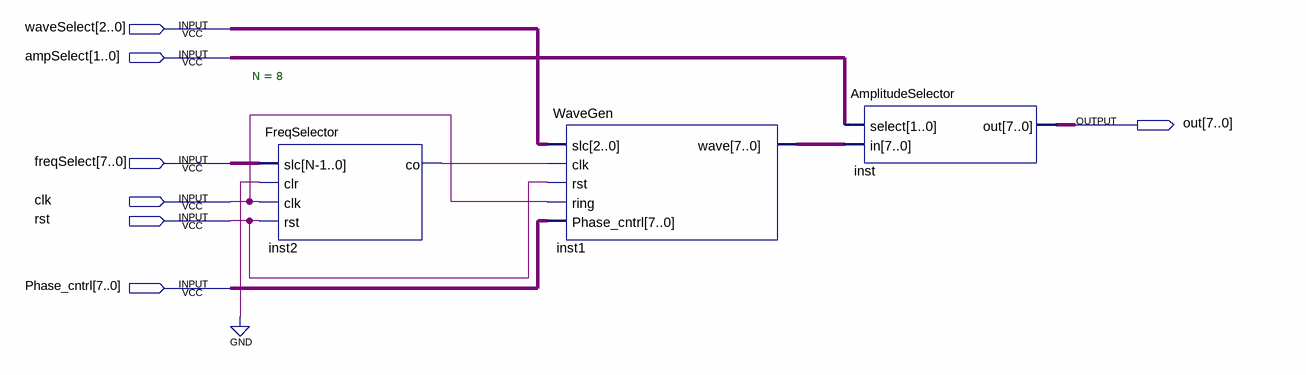
[diagram p0: schematic sheet]
// Quartus schematic FuncGen.bdf as structural Verilog: 3 symbols, 7 pins
module FuncGen (
  input  [2:0] waveSelect,
  input  [1:0] ampSelect,
  input  [7:0] freqSelect,
  input  clk,
  input  rst,
  input  [7:0] Phase_cntrl,
  output [7:0] out
);

  wire inst2_co;
  wire [7:0] inst1_wave;

  FreqSelector #(.N(8)) inst2 (.slc(freqSelect), .clr(1'b0), .clk(clk), .rst(rst), .co(inst2_co));
  WaveGen inst1 (.slc(waveSelect), .clk(inst2_co), .rst(rst), .ring(clk), .Phase_cntrl(Phase_cntrl), .wave(inst1_wave));
  AmplitudeSelector inst (.select(ampSelect), .in(inst1_wave), .out(out));
endmodule
